# EAGLE design rf (EAGLE 7.5.0)
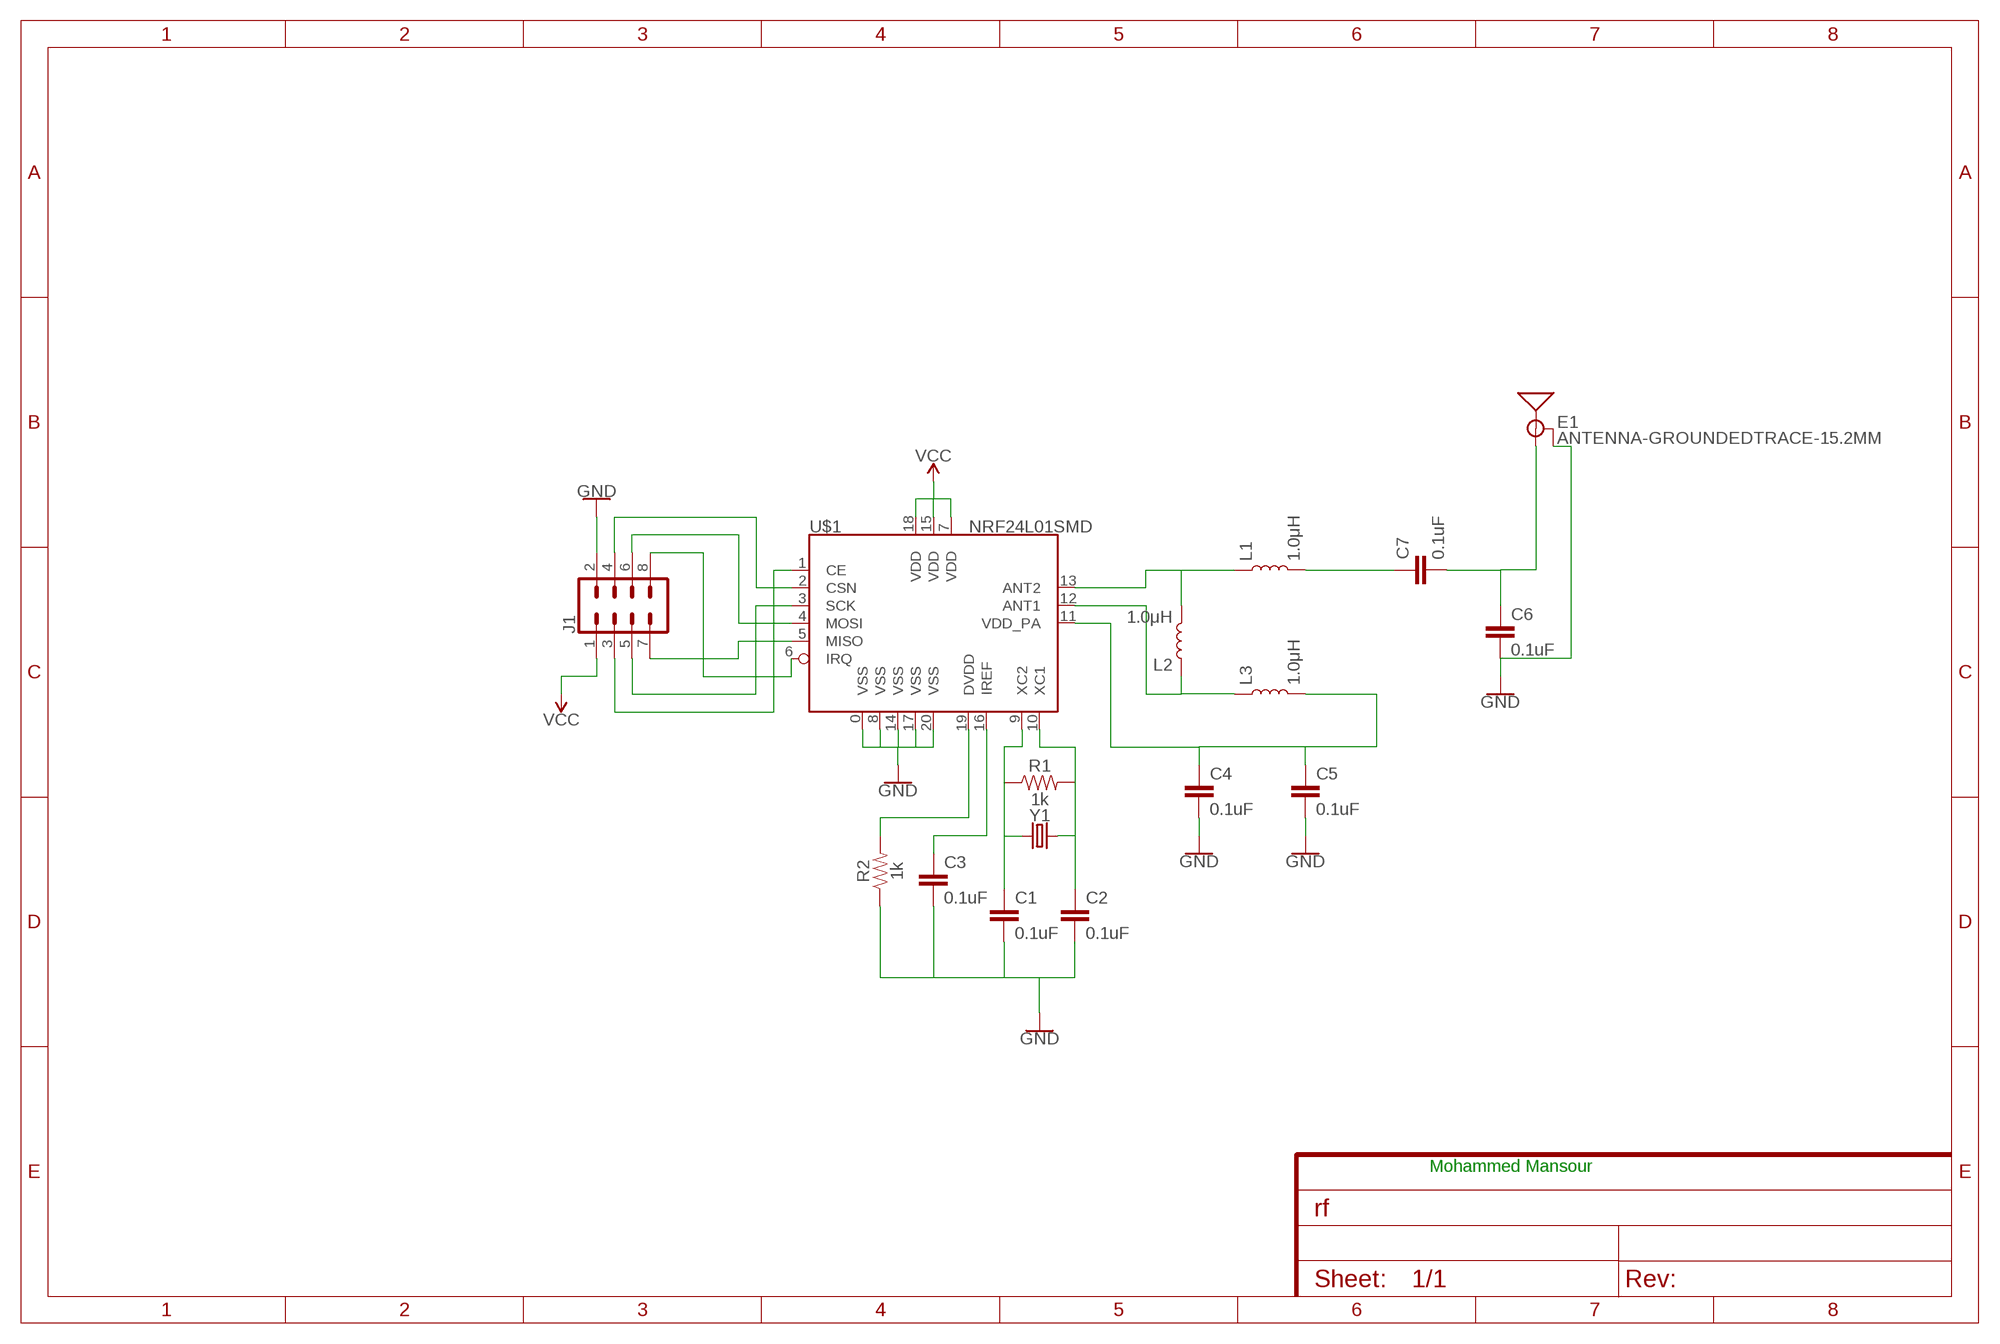
[diagram p0: schematic, sheet 1]

## Parts
C1  0.1uF  0.1UF-0402T-6.3V-10%-X7R  [0402-TIGHT]
C2  0.1uF  0.1UF-0402T-6.3V-10%-X7R  [0402-TIGHT]
C3  0.1uF  0.1UF-0402T-6.3V-10%-X7R  [0402-TIGHT]
C4  0.1uF  0.1UF-0402T-6.3V-10%-X7R  [0402-TIGHT]
C5  0.1uF  0.1UF-0402T-6.3V-10%-X7R  [0402-TIGHT]
C6  0.1uF  0.1UF-0402T-6.3V-10%-X7R  [0402-TIGHT]
C7  0.1uF  0.1UF-0402T-6.3V-10%-X7R  [0402-TIGHT]
E1  ANTENNA-GROUNDEDTRACE-15.2MM  [TRACE_ANTENNA_2.4GHZ_15.2MM]
J1  CONN_04X2  [2X4]
L1  1.0μH  1.0μH-0805_WIDE-1.0μH-1.4A-0.07OHM-1.4MM_H  [0805-WIDE]
L2  1.0μH  1.0μH-0805_WIDE-1.0μH-1.4A-0.07OHM-1.4MM_H  [0805-WIDE]
L3  1.0μH  1.0μH-0805_WIDE-1.0μH-1.4A-0.07OHM-1.4MM_H  [0805-WIDE]
R1  1k  1KOHM-0402T-1/16W-1%  [0402-TIGHT]
R2  1k  1KOHM-0402T-1/16W-1%  [0402-TIGHT]
U$1  NRF24L01SMD  [QFN20-4X4MM]
Y1  CRYSTALSMD-3.2X1.5  [CRYSTAL-SMD-3.2X1.5MM]

## Nets
GND: C1.2 C2.2 C3.2 C4.2 C5.2 C6.2 E1.GND J1.2 R2.1 U$1.0(VSS) U$1.8(VSS) U$1.14(VSS) U$1.17(VSS) U$1.20(VSS)
N$1: J1.3 U$1.1(CE)
N$2: J1.4 U$1.2(CSN)
N$3: C1.1 R1.1 U$1.9(XC2) Y1.P$1
N$4: C2.1 R1.2 U$1.10(XC1) Y1.P$2
N$5: J1.5 U$1.3(SCK)
N$6: R2.2 U$1.19(DVDD)
N$7: C3.1 U$1.16(IREF)
N$8: J1.6 U$1.4(MOSI)
N$9: J1.7 U$1.5(MISO)
N$10: L1.1 L2.2 U$1.13(ANT2)
N$11: C7.1 L1.2
N$12: C6.1 C7.2 E1.ANT(SIGNAL)
N$13: C4.1 C5.1 L3.2 U$1.11(VDD_PA)
N$14: J1.8 U$1.6(IRQ)
N$17: L2.1 L3.1 U$1.12(ANT1)
VCC: J1.1 U$1.7(VDD) U$1.15(VDD) U$1.18(VDD)

## Notes on the sheet
- Mohammed Mansour

## Library data of the parts
C1-C7 = SparkFun-Capacitors:0.1UF: 0.1µF ceramic capacitors A capacitor is a passive two-terminal electrical component used to store electrical energy temporarily in an electric field.; PROD_ID: CAP-14993
E1 = SparkFun-RF:ANTENNA-GROUNDED: Antenna w/ Ground Connection 2.4GHz antennae with signal and ground terminals. TRACE_ANTENNA_2.4GHZ_15.2MM - Meander Trace antenna 15.2 x 5.7mm footprint Based on layout from TI app note AN043 <http://www.ti.com/lit/an/swra117d/swra117d.pdf>. TRACE_ANTENNA_2.4GHZ_25.7MM - Inverted F trace antenna 25.7 x 7.5 mm footprint. Based on layout from TI design note DN0007 <http://www.ti.com/lit/an/swru120b/swru120b.pdf>.
J1 = SparkFun-Connectors:CONN_04X2: Multi connection point. Often used as Generic Header-pin footprint for 0.1 inch spaced/style header connections On any of the 0.1 inch spaced packages, you can populate with these: Break Away Headers - Straight <https://www.sparkfun.com/products/116> (PRT-00116) Break Away Male Headers - Right Angle <https://www.sparkfun.com/products/553> (PRT-00553) Female Headers <https://www.sparkfun.com/products/115> (PRT-00115) Break Away Headers - Machine Pin <https://www.sparkfun.com/products/117> (PRT-00117) Break Away Female Headers - Swiss Machine Pin <https://www.sparkfun.com/products/743> (PRT-00743)
L1-L3 = SparkFun-Coils:1.0μH: 1.0μH Inductor Resist changes in electrical current. Basically a coil of wire. SparkFun Products: SparkFun Edge <https://www.sparkfun.com/products/15170>; PROD_ID: NDUC-14237
R1 R2 = SparkFun-Resistors:1KOHM: 1kΩ resistor A resistor is a passive two-terminal electrical component that implements electrical resistance as a circuit element. Resistors act to reduce current flow, and, at the same time, act to lower voltage levels within circuits. - Wikipedia; PROD_ID: RES-14342
U$1 = SparkFun-RF:NRF24L01: Nordic nrf24L01 2.4GHz Low-power Transceiver This is the very popular, low cost, very low power RF transceiver from Nordic Semiconductor. Simple SPI interface. SparkFun Products 2.4GHz Transceiver IC - nRF24L01+ <https://www.sparkfun.com/products/690> (COM-00690) SparkFun Transceiver Breakout - nRF24L01+ (RP-SMA) <https://www.sparkfun.com/products/705> (WRL-00705) SparkFun Transceiver Breakout - nRF24L01+ <https://www.sparkfun.com/products/691> (COM-00691); PROD_ID: IC-08950; SF_ID: COM-00690
Y1 = SparkFun-Clocks:CRYSTAL: Crystals (Generic) These are passive quartz crystals, which can be used as a clock source for a microcontroller. Crystal's are two-terminal devices. They require external "load" capacitors to generate an oscillating signal.

## Board
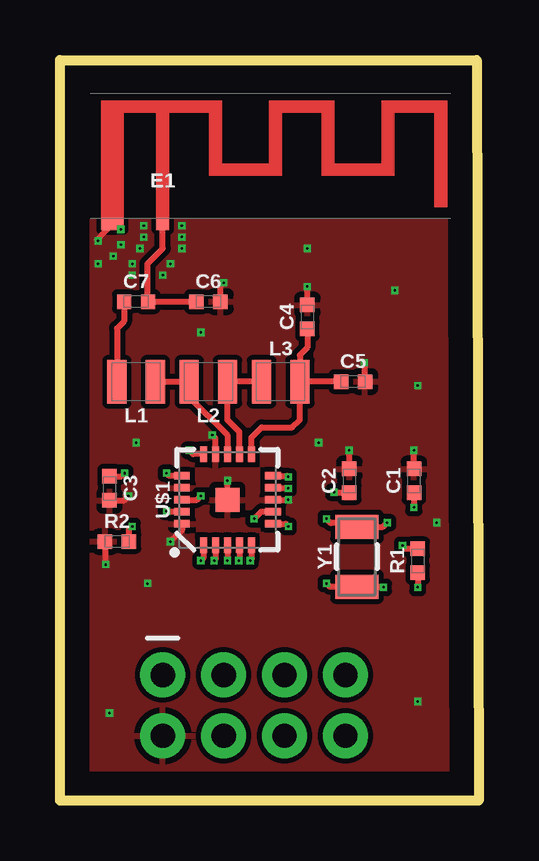
[diagram p1: board, top side]
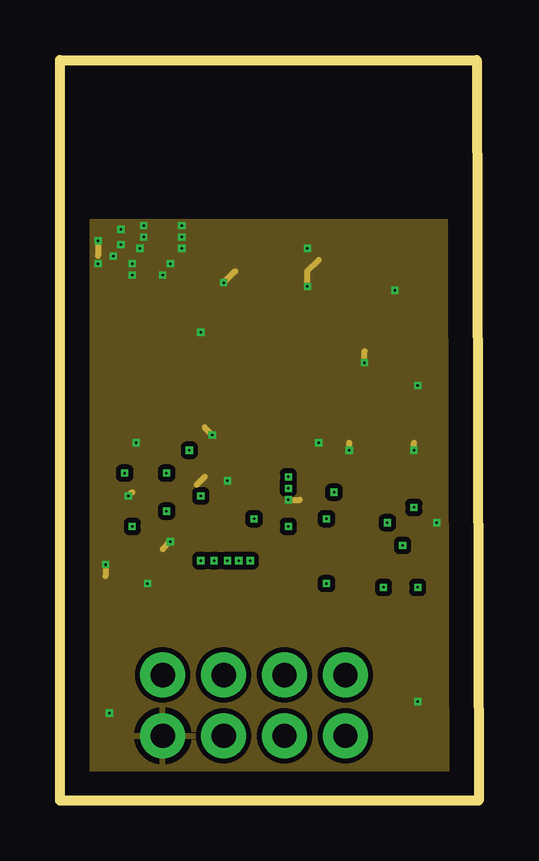
[diagram p2: board, inner layer Route2]
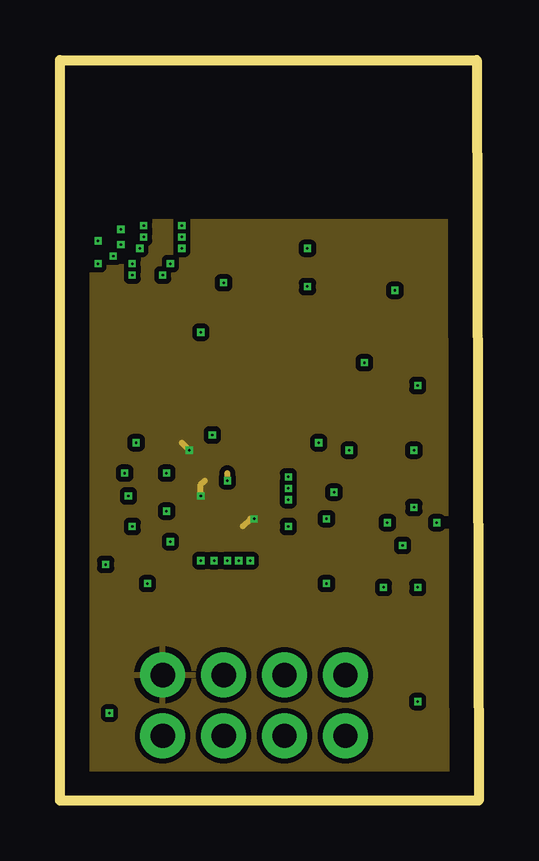
[diagram p3: board, inner layer Route15]
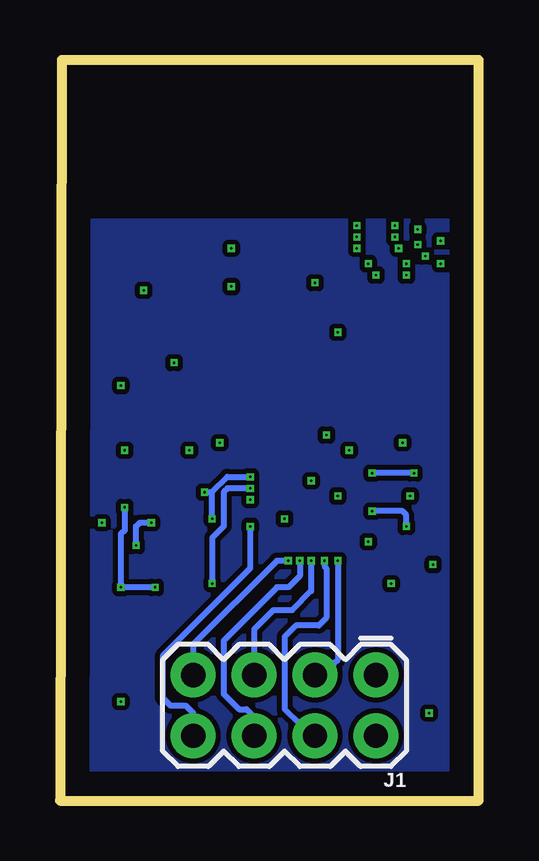
[diagram p4: board, bottom side, seen from below]

Size 17.46 x 30.88 mm. Coordinates in mm from the lower left corner, seen from the top.
Outline: 0,0 0,30.88 17.38,30.88 17.46,0 0,0
Copper layers (1+2*15*16): Top 0.035mm / dielectric 0.5mm / Route2 0.035mm / dielectric 0.15mm / Route15 0.035mm / dielectric 0.2mm / Bottom 0.035mm
Design rules "default *": minimum track width 10mil, minimum drill 24mil, track to track 8mil, track to pad 8mil, pad to pad 8mil, via to via 8mil, smd to smd 8mil, copper to edge 40mil, drill to drill 8mil, minimum pad ring 10mil, minimum via ring 0.1mm, stop-mask expansion 4mil, vias tented up to drill 0mil, thermal gap 10mil

### Footprints (pad centres in the part's own frame; a part is rotated, then mirrored left to right if it is on the bottom)
0402-TIGHT = smd 0.6 x 0.6: 1 -0.5,0; 2 0.5,0
TRACE_ANTENNA_2.4GHZ_15.2MM = smd 0.5 x 0.5: ANT 0,-0.25 | smd 0.9 x 0.5: GND -2.1,-0.25
2X4 = drill 1.016 pad 1.88: 1 -3.81,-1.27; 2 -3.81,1.27; 3 -1.27,-1.27; 4 -1.27,1.27; 5 1.27,-1.27; 6 1.27,1.27; 7 3.81,-1.27; 8 3.81,1.27
0805-WIDE = smd 0.8 x 1.8: 1 -0.8,0; 2 0.8,0
QFN20-4X4MM = smd 1 x 1: 0 0,0 | smd 0.65 x 0.3: 1 -1.9,1; 2 -1.9,0.5; 3 -1.9,0; 4 -1.9,-0.5; 5 -1.9,-1; 11 1.9,-1; 12 1.9,-0.5; 13 1.9,0; 14 1.9,0.5; 15 1.9,1 | smd 0.3 x 0.65: 6 -1,-1.9; 7 -0.5,-1.9; 8 0,-1.9; 9 0.5,-1.9; 10 1,-1.9; 16 1,1.9; 17 0.5,1.9; 18 0,1.9; 19 -0.5,1.9; 20 -1,1.9
CRYSTAL-SMD-3.2X1.5MM = smd 1 x 1.8: P$1 -1.25,0; P$2 1.25,0

### Placement (x,y rotation side)
C1  14.76,13.34 90 top
C2  12.06,13.34 90 top
C3  2.06,13.02 270 top
C4  10.32,20.16 90 top
C5  12.22,17.46 0 top
C6  6.19,20.8 0 top
C7  3.17,20.8 0 top
E1  4.29,24.29 0 top
J1  8.1,3.97 180 bottom
L1  3.17,17.46 180 top
L2  6.19,17.46 180 top
L3  9.21,17.46 0 top
R1  14.92,10 90 top
R2  2.38,10.79 0 top
U$1  6.99,12.54 90 top
Y1  12.38,10.16 90 top

### Tracks (layer width: path | path; a pad name or v marks a point on that pad's centre or on a via)
GND  (via drill 0.1)
  Top 0.254: C4.2 v10.32,21.43 | C6.2 6.69,21.45 v6.83,21.59 | E1.GND 1.55,23.37 v1.59,23.34 | C5.2 12.72,18.23 v12.7,18.26 | C2.2 v12.06,14.61 | C1.2 v14.76,14.61 | U$1.8 v9.53,12.54 | R2.1 1.88,9.87 v1.91,9.84 | C3.2 2.67,12.52 v2.86,12.7 | U$1.20 5.08,11.28 v4.6,10.79 | U$1.14 6.49,15.11 v6.35,15.24 | U$1.0 v6.99,13.34
  Route2 0.254: v10.32,21.43 10.32,22.07 10.79,22.54 | v6.83,21.59 7.3,22.07 | v1.59,23.34 1.59,22.7 | v12.7,18.26 12.7,18.73 | v12.06,14.61 12.06,14.92 | v14.76,14.61 14.76,14.92 | v9.53,12.54 10,12.54 | v1.91,9.84 1.91,9.37 | v2.86,12.7 3.02,12.86 | v4.6,10.79 4.29,10.48 | v6.35,15.24 6.03,15.56 | 5.71,13.18 6.03,13.49
  Route15 0.254: v6.99,13.34 6.99,13.65
  other vias: 13.97,21.27 10.32,23.02 14.92,17.3 5.87,19.53 10.79,14.92 3.17,14.92 3.65,9.05 2.06,3.65 14.92,4.13 15.72,11.59 3.49,23.97 5.08,23.97 5.08,23.5 3.49,23.5 5.08,23.02 3.33,23.02 4.6,22.38 3.02,22.38 4.29,21.91 3.02,21.91 2.54,23.81 2.54,23.18 2.22,22.7 1.59,22.38
  pour Route2: 0,0 0,24.13 17.46,24.13 17.46,0
  pour Top: 0,0 0,24.13 17.46,24.13 17.46,0
N$1  (via drill 0.1)
  Top 0.254: U$1.1 5.99,10.11 v5.87,10
  Bottom 0.254: v5.87,10 5.87,5.87 6.03,5.71 6.35,5.71 J1.3
N$2  (via drill 0.1)
  Top 0.254: U$1.2 6.49,10.06 v6.43,10
  Bottom 0.254: v6.43,10 6.43,9.76 6.35,9.68 6.35,7.62 6.67,7.3 7.62,7.3 8.1,6.83 8.1,3.81 7.46,3.17 7.3,3.17 J1.4
N$3  (via drill 0.1)
  Top 0.254: C1.1 v14.76,12.22 | R1.1 v14.92,8.89 | v13.49,8.89 13.47,8.91 Y1.P$1 11.25,8.91 v11.11,9.05 | U$1.9 9.5,13.04 v9.53,13.02
  Bottom 0.254: v14.76,12.22 14.76,11.27 14.92,11.11 v14.92,8.89 v13.49,8.89 | v9.53,13.02 10.48,13.02 10.64,12.86 10.64,11.43 11.11,10.95 v11.11,9.05
N$4  (via drill 0.1)
  Top 0.254: U$1.10 9.48,13.54 v9.53,13.49 | C2.1 11.45,12.84 v11.43,12.86 | v11.11,11.75 11.29,11.57 12.22,11.57 Y1.P$2 13.47,11.41 v13.65,11.59 | R1.2 14.42,10.5 v14.29,10.64
  Bottom 0.254: v11.43,12.86 11.11,12.86 | 11.11,12.86 10.48,13.49 v9.53,13.49 | v11.11,11.75 11.11,12.86 | v14.29,10.64 14.29,11.43 14.13,11.59 v13.65,11.59
N$5  (via drill 0.1)
  Top 0.254: U$1.3 v6.99,10
  Bottom 0.254: v6.99,10 6.99,8.73 7.78,7.94 8.57,7.94 9.37,7.14 J1.5
N$6  (via drill 0.1)
  Top 0.254: R2.2 2.88,11.29 v3.02,11.43 | U$1.19 4.47,12.04 v4.45,12.06
  Bottom 0.254: v3.02,11.43 3.02,11.91 3.17,12.06 v4.45,12.06
N$7  (via drill 0.1)
  Top 0.254: U$1.16 4.56,13.54 v4.45,13.65 | C3.1 2.56,13.52 v2.7,13.65
  Bottom 0.254: v2.7,13.65 v4.45,13.65
N$8  (via drill 0.1)
  Top 0.254: U$1.4 7.49,10.03 v7.46,10
  Bottom 0.254: v7.46,10 7.46,9.37 7.94,8.89 8.41,8.89 10.64,6.67 10.64,4.45 10,3.81 9.68,3.81 9.37,3.49 J1.6
N$9  (via drill 0.1)
  Top 0.254: U$1.5 7.99,10.05 v7.94,10
  Bottom 0.254: v7.94,10 8.41,10 11.91,6.51 J1.7
N$10
  Top 0.254: L1.1 L2.2 5.39,16.83 6.99,15.24 U$1.13
N$11
  Top 0.254: C7.1 2.67,19.98 2.38,19.68 L1.2
N$12
  Top 0.254: C6.1 C7.2 3.65,20.82 3.65,22.38 4.29,23.02 E1.ANT
N$13
  Top 0.254: C4.1 10.32,18.89 10,18.57 L3.2 | C5.1 L3.2 | U$1.11 7.99,15.13 8.41,15.56 9.68,15.56 10,15.88 L3.2
N$14  (via drill 0.1)
  Top 0.254: U$1.6 9.41,11.54 v9.53,11.43
  Bottom 0.254: v9.53,11.43 9.53,9.68 13.18,6.03 13.18,4.29 12.86,3.97 12.22,3.97 11.91,3.65 J1.8
N$15
  pour Bottom: 0,0 0,24.13 17.46,24.13 17.46,0
N$17
  Top 0.254: L3.1 L2.1 6.99,15.88 7.49,15.38 U$1.12
VCC  (via drill 0.1)
  Top 0.254: U$1.15 5.56,14.44 v5.4,14.61 | U$1.7 8.39,12.04 v8.1,11.75 | U$1.18 5.71,12.54 v5.87,12.7
  Route15 0.254: v5.4,14.61 5.08,14.92 | v8.1,11.75 7.94,11.75 7.62,11.43 | v5.87,12.7 5.87,13.18 6.03,13.34
  pour Route15: 0,0 0,24.13 17.46,24.13 17.46,0